# Altium schematic sheet Connectors.SchDoc: Connectors
size A3; Author: Silard Gal; SheetNumber: 7; SheetTotal: 7
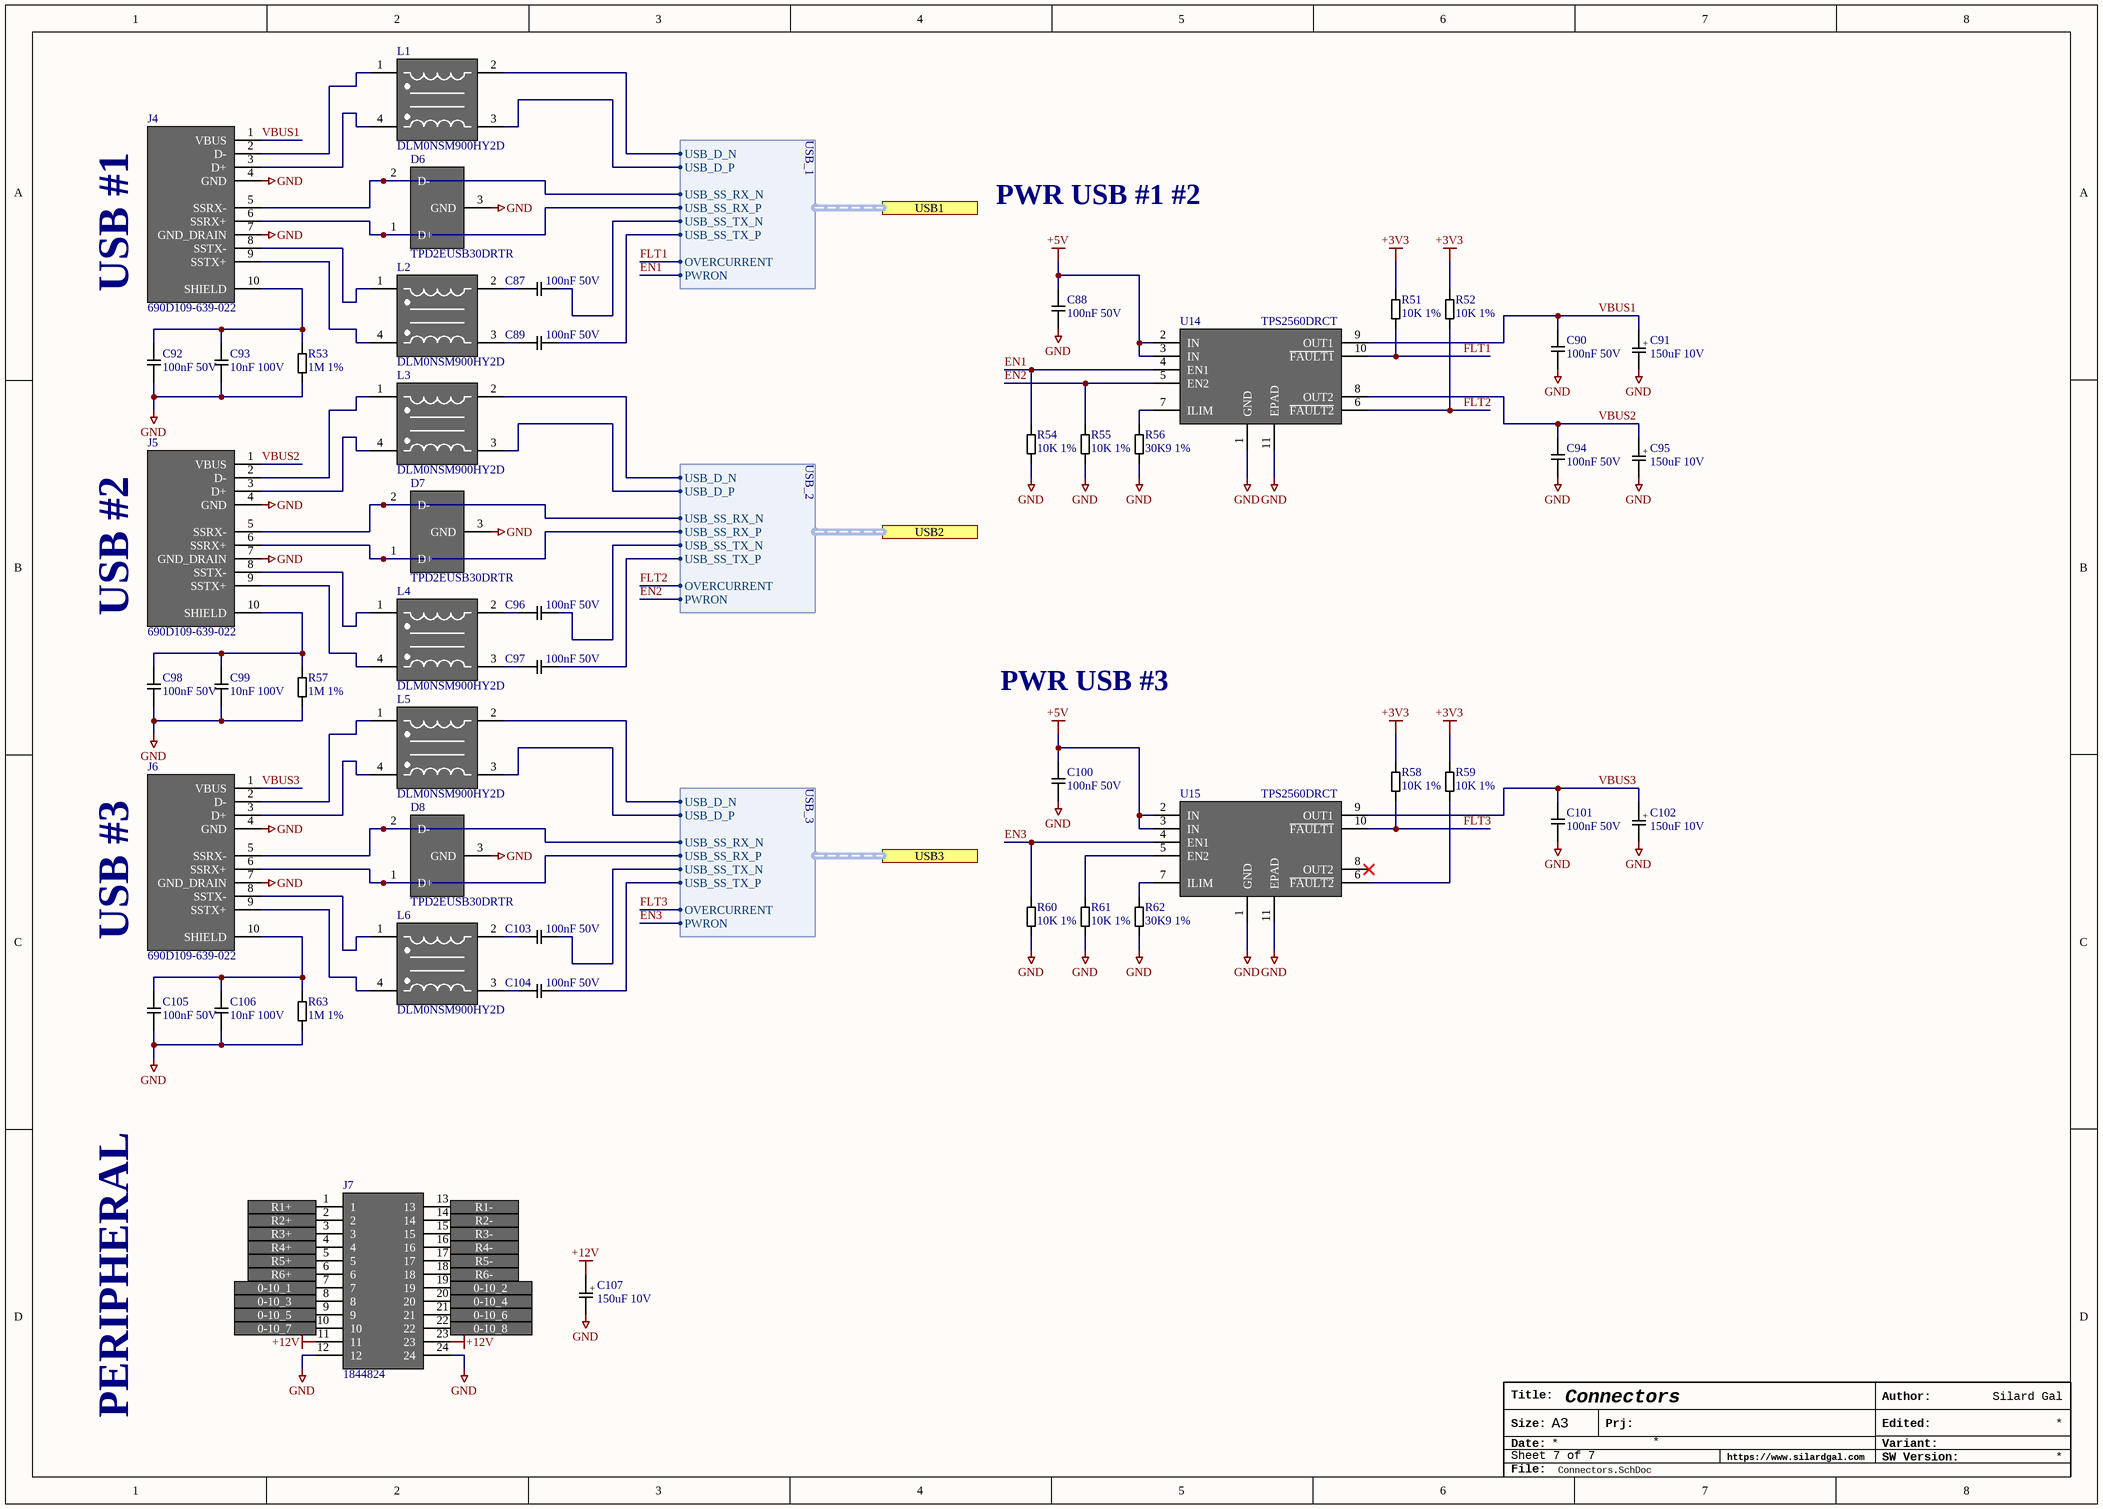
[diagram p0: Connectors.SchDoc]

## Parts
C87  100nF 50V  [CAPC1005X06N]
C88  100nF 50V  [CAPC1608X06N]
C89  100nF 50V  [CAPC1005X06N]
C90  100nF 50V  [CAPC1608X06N]
C91  150uF 10V  [CAP66x66x58]
C92  100nF 50V  [CAPC1608X06N]
C93  10nF 100V  [CAPC1608X06N]
C94  100nF 50V  [CAPC1608X06N]
C95  150uF 10V  [CAP66x66x58]
C96  100nF 50V  [CAPC1005X06N]
C97  100nF 50V  [CAPC1005X06N]
C98  100nF 50V  [CAPC1608X06N]
C99  10nF 100V  [CAPC1608X06N]
C100  100nF 50V  [CAPC1608X06N]
C101  100nF 50V  [CAPC1608X06N]
C102  150uF 10V  [CAP66x66x58]
C103  100nF 50V  [CAPC1005X06N]
C104  100nF 50V  [CAPC1005X06N]
C105  100nF 50V  [CAPC1608X06N]
C106  10nF 100V  [CAPC1608X06N]
C107  150uF 10V  [CAP66x66x58]
D6  TPD2EUSB30DRTR  [SOTFL35P100X50-3N]
D7  TPD2EUSB30DRTR  [SOTFL35P100X50-3N]
D8  TPD2EUSB30DRTR  [SOTFL35P100X50-3N]
J4  690D109-639-022  [690D109-639-022]
J5  690D109-639-022  [690D109-639-022]
J6  690D109-639-022  [690D109-639-022]
J7  1844824  [PHOENIX_1844824]
L1  DLM0NSM900HY2D  [DLM0NSM900HY2D]
L2  DLM0NSM900HY2D  [DLM0NSM900HY2D]
L3  DLM0NSM900HY2D  [DLM0NSM900HY2D]
L4  DLM0NSM900HY2D  [DLM0NSM900HY2D]
L5  DLM0NSM900HY2D  [DLM0NSM900HY2D]
L6  DLM0NSM900HY2D  [DLM0NSM900HY2D]
R51  10K 1%  [RESC1608X06N]
R52  10K 1%  [RESC1608X06N]
R53  1M 1%  [RESC1608X06N]
R54  10K 1%  [RESC1608X06N]
R55  10K 1%  [RESC1608X06N]
R56  30K9 1%  [RESC1608X06N]
R57  1M 1%  [RESC1608X06N]
R58  10K 1%  [RESC1608X06N]
R59  10K 1%  [RESC1608X06N]
R60  10K 1%  [RESC1608X06N]
R61  10K 1%  [RESC1608X06N]
R62  30K9 1%  [RESC1608X06N]
R63  1M 1%  [RESC1608X06N]
U14  TPS2560DRCT  [10VSON]
U15  TPS2560DRCT  [10VSON]

## Ports
0-10_1, 0-10_2, 0-10_3, 0-10_4, 0-10_5, 0-10_6, 0-10_7, 0-10_8, R1+, R1-, R2+, R2-, R3+, R3-, R4+, R4-, R5+, R5-, R6+, R6-, USB1 (harness USB_1), USB2 (harness USB_2), USB3 (harness USB_3)

## Harnesses
USB_3: USB_D_P, USB_D_N, USB_SS_TX_P, USB_SS_TX_N, USB_SS_RX_P, USB_SS_RX_N, OVERCURRENT, PWRON
USB_2: USB_D_P, USB_D_N, USB_SS_TX_P, USB_SS_TX_N, USB_SS_RX_P, USB_SS_RX_N, OVERCURRENT, PWRON
USB_1: USB_D_P, USB_D_N, USB_SS_TX_P, USB_SS_TX_N, USB_SS_RX_P, USB_SS_RX_N, OVERCURRENT, PWRON

## Nets
+3V3: R51.2 R52.2 R58.2 R59.2
+5V: C88.2 C100.2 U14.2(IN) U14.3(IN) U15.2(IN) U15.3(IN)
+12V: C107.1 J7.11 J7.23
GND: C88.1 C90.1 C91.2 C92.1 C93.1 C94.1 C95.2 C98.1 C99.1 C100.1 C101.1 C102.2 C105.1 C106.1 C107.2 D6.3(GND) D7.3(GND) D8.3(GND) J4.4(GND) J4.7(GND_DRAIN) J5.4(GND) J5.7(GND_DRAIN) J6.4(GND) J6.7(GND_DRAIN) J7.12 J7.24 R53.1 R54.1 R55.1 R56.1 R57.1 R60.1 R61.1 R62.1 R63.1 U14.1(GND) U14.11(EPAD) U15.1(GND) U15.11(EPAD)
0-10_1: J7.7 ; port 0-10_1
0-10_2: J7.19 ; port 0-10_2
0-10_3: J7.8 ; port 0-10_3
0-10_4: J7.20 ; port 0-10_4
0-10_5: J7.9 ; port 0-10_5
0-10_6: J7.21 ; port 0-10_6
0-10_7: J7.10 ; port 0-10_7
0-10_8: J7.22 ; port 0-10_8
EN1: R54.2 U14.4(EN1) ; port USB1.PWRON
EN2: R55.2 U14.5(EN2) ; port USB2.PWRON
EN3: R60.2 U15.4(EN1) ; port USB3.PWRON
FLT1: R51.1 U14.10(~{FAULT1}) ; port USB1.OVERCURRENT
FLT2: R52.1 U14.6(~{FAULT2}) ; port USB2.OVERCURRENT
FLT3: R58.1 U15.10(~{FAULT1}) ; port USB3.OVERCURRENT
R1+: J7.1 ; port R1+
R1-: J7.13 ; port R1-
R2+: J7.2 ; port R2+
R2-: J7.14 ; port R2-
R3+: J7.3 ; port R3+
R3-: J7.15 ; port R3-
R4+: J7.4 ; port R4+
R4-: J7.16 ; port R4-
R5+: J7.5 ; port R5+
R5-: J7.17 ; port R5-
R6+: J7.6 ; port R6+
R6-: J7.18 ; port R6-
VBUS1: C90.2 C91.1 J4.1(VBUS) U14.9(OUT1)
VBUS2: C94.2 C95.1 J5.1(VBUS) U14.8(OUT2)
VBUS3: C101.2 C102.1 J6.1(VBUS) U15.9(OUT1)
NetC87_1: C87.1 L2.2
NetC87_2: C87.2 ; port USB1.USB_SS_TX_N
NetC89_1: C89.1 L2.3
NetC89_2: C89.2 ; port USB1.USB_SS_TX_P
NetC92_2: C92.2 C93.2 J4.10(SHIELD) R53.2
NetC96_1: C96.1 L4.2
NetC96_2: C96.2 ; port USB2.USB_SS_TX_N
NetC97_1: C97.1 L4.3
NetC97_2: C97.2 ; port USB2.USB_SS_TX_P
NetC98_2: C98.2 C99.2 J5.10(SHIELD) R57.2
NetC103_1: C103.1 L6.2
NetC103_2: C103.2 ; port USB3.USB_SS_TX_N
NetC104_1: C104.1 L6.3
NetC104_2: C104.2 ; port USB3.USB_SS_TX_P
NetC105_2: C105.2 C106.2 J6.10(SHIELD) R63.2
NetD6_1: D6.1(D+) J4.6(SSRX+) ; port USB1.USB_SS_RX_P
NetD6_2: D6.2(D-) J4.5(SSRX-) ; port USB1.USB_SS_RX_N
NetD7_1: D7.1(D+) J5.6(SSRX+) ; port USB2.USB_SS_RX_P
NetD7_2: D7.2(D-) J5.5(SSRX-) ; port USB2.USB_SS_RX_N
NetD8_1: D8.1(D+) J6.6(SSRX+) ; port USB3.USB_SS_RX_P
NetD8_2: D8.2(D-) J6.5(SSRX-) ; port USB3.USB_SS_RX_N
NetJ4_2: J4.2(D-) L1.1
NetJ4_3: J4.3(D+) L1.4
NetJ4_8: J4.8(SSTX-) L2.1
NetJ4_9: J4.9(SSTX+) L2.4
NetJ5_2: J5.2(D-) L3.1
NetJ5_3: J5.3(D+) L3.4
NetJ5_8: J5.8(SSTX-) L4.1
NetJ5_9: J5.9(SSTX+) L4.4
NetJ6_2: J6.2(D-) L5.1
NetJ6_3: J6.3(D+) L5.4
NetJ6_8: J6.8(SSTX-) L6.1
NetJ6_9: J6.9(SSTX+) L6.4
NetL1_2: L1.2 ; port USB1.USB_D_N
NetL1_3: L1.3 ; port USB1.USB_D_P
NetL3_2: L3.2 ; port USB2.USB_D_N
NetL3_3: L3.3 ; port USB2.USB_D_P
NetL5_2: L5.2 ; port USB3.USB_D_N
NetL5_3: L5.3 ; port USB3.USB_D_P
NetR56_2: R56.2 U14.7(ILIM)
NetR59_1: R59.1 U15.6(~{FAULT2})
NetR61_2: R61.2 U15.5(EN2)
NetR62_2: R62.2 U15.7(ILIM)

Not connected (* = marked no-connect by the designer): U15 8(OUT2)*

## Notes on the sheet
- USB #1
- PWR USB #1 #2
- USB #2
- PWR USB #3
- USB #3
- PERIPHERAL
- Title:
- Author:
- Size:
- Date:
- A3
- Prj:
- https://www.silardgal.com
- SW Version:
- Variant:
- Edited:
- File:
- (in symbol 150uF 10V) +

## Library data of the parts
C87 C89 C96 C97 C103 C104 = 100nF 50V_1: 0.1 µF ±10% 16V Ceramic Capacitor X7R 0402 (1005 Metric); MPN: GRM155R71C104KA88J
C88 C90 C92 C94 C98 C100 C101 C105 = 100nF 50V: 0.1 µF ±10% 50V Ceramic Capacitor X7R 0603 (1608 Metric); MPN: GCM188R71H104KA57D
C91 C95 C102 C107 = 150uF 10V: 150 µF 10 V Aluminum - Polymer Capacitors Radial, Can - SMD 30mOhm 2000 Hrs @ 105°C; MPN: 875105244011
C93 C99 C106 = 10nF 100V: 10000 pF ±10% 100V Ceramic Capacitor X7R 0603 (1608 Metric); MPN: GCM188R72A103KA37D
D6-D8 = TPD2EUSB30DRTR: 8V Clamp 5A (8/20µs) Ipp Tvs Diode Surface Mount SOT-3; MPN: TPD2EUSB30DRTR
J4-J6 = 690D109-639-022: USB-A (USB TYPE-A) USB 3.0 Receptacle Connector 9 Position Through Hole, Right Angle; MPN: 690D109-639-022
J7 = 1844824: 24 Position Terminal Block Header, Male Pins, Shrouded (4 Side) 0.100" (2.54mm) 90°, Right Angle Through Hole; MPN: 1844824
L1-L6 = DLM0NSM900HY2D: 2 Line Common Mode Choke Surface Mount 90 Ohms @ 100 MHz 100mA DCR 4Ohm; MPN: DLM0NSM900HY2D
R51 R52 R54 R55 R58-R61 = 10K 1%: 10 kOhms ±1% 0.1W, 1/10W Chip Resistor 0603 (1608 Metric) Automotive AEC-Q200 Thick Film; MPN: ERJ-3EKF1002V
R53 R57 R63 = 1M 1%: RES SMD 1M OHM 1% 1/10W 0603; MPN: ERJ-3EKF1004V
R56 R62 = 30K9 1%: 30.9 kOhms ±1% 0.1W, 1/10W Chip Resistor 0603 (1608 Metric) Automotive AEC-Q200 Thick Film; MPN: ERJ-3EKF3092V
U14 U15 = TPS2560DRCT: Power Switch/Driver 1:2 N-Channel 2.5A 10-VSON (3x3); MPN: TPS2560DRCT